# Altium schematic sheet OSSI-1 Beacon_2.SchDoc: TITLE:
size 410 x 286 mm; Date: Date:; >LAST_DATE_TIME: 01/11/2015 13:17:37; Sheet:: Sheet:; >SHEET: 3; REV:: REV:; Document Number:: Document Number:; >DRAWING_NAME: OSSI-1 Beacon.sch
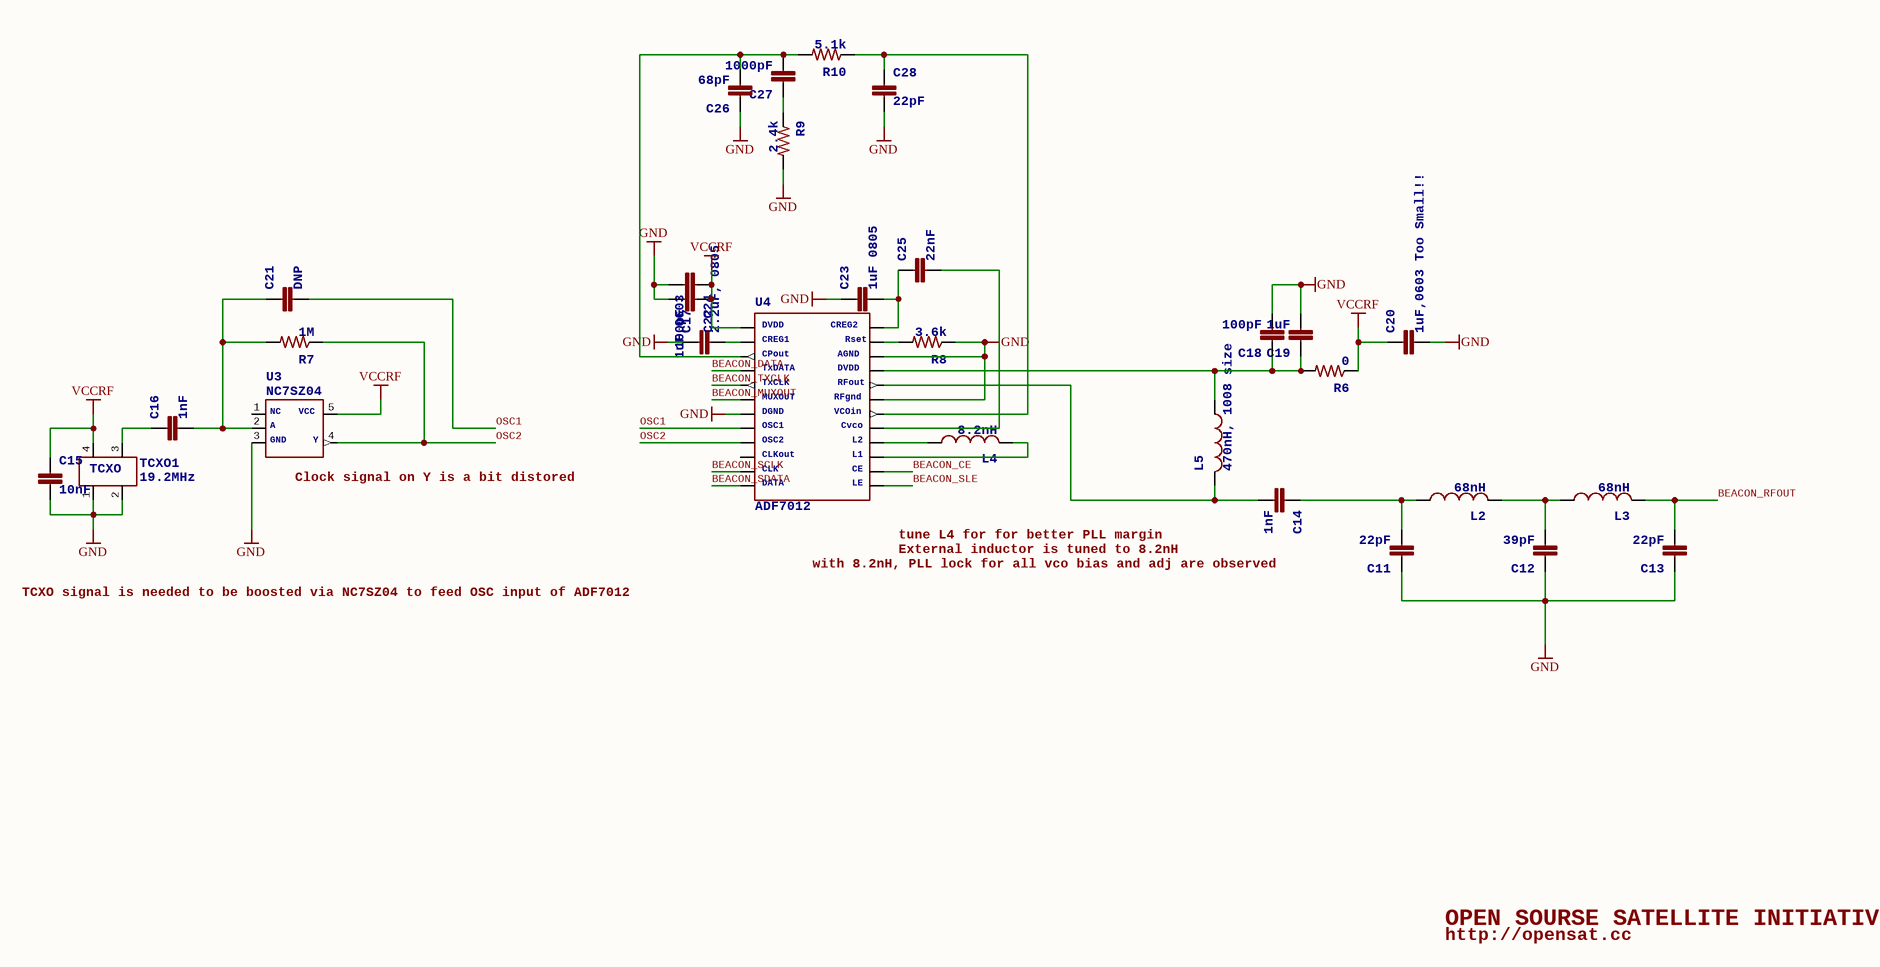
[diagram p0: OSSI-1 Beacon_2.SchDoc]

## Parts
C11  >NAME: C11  [C0603(1608)]  (hidden comment: 22pF)
C12  >NAME: C12  [C0603(1608)]  (hidden comment: 39pF)
C13  >NAME: C13  [C0603(1608)]  (hidden comment: 22pF)
C14  >NAME: C14  [C0603(1608)]  (hidden comment: 1nF)
C15  >NAME: C15  [C0603(1608)]  (hidden comment: 10nF)
C16  >NAME: C16  [C0603(1608)]  (hidden comment: 1nF)
C17  >NAME: C17  [C0805(2012)]  (hidden comment: 2.2uF, 0805)
C18  >NAME: C18  [C0603(1608)]  (hidden comment: 100pF)
C19  >NAME: C19  [C0603(1608)]  (hidden comment: 1uF)
C20  >NAME: C20  [C0603(1608)]  (hidden comment: 1uF,0603 Too Small!!)
C21  >NAME: C21  [C0603(1608)]  (hidden comment: DNP)
C22  >NAME: C22  [C0603(1608)]  (hidden comment: 100pF)
C23  >NAME: C23  [C0805(2012)]  (hidden comment: 1uF 0805)
C24  >NAME: C24  [C0603(1608)]  (hidden comment: 1uF,0603)
C25  >NAME: C25  [C0603(1608)]  (hidden comment: 22nF)
C26  >NAME: C26  [C0603(1608)]  (hidden comment: 68pF)
C27  >NAME: C27  [C0603(1608)]  (hidden comment: 1000pF)
C28  >NAME: C28  [C0603(1608)]  (hidden comment: 22pF)
L2  >NAME: L2  [L0603(1608)]  (hidden comment: 68nH)
L3  >NAME: L3  [L0603(1608)]  (hidden comment: 68nH)
L4  >NAME: L4  [L0603(1608)]  (hidden comment: 8.2nH)
L5  >NAME: L5  [L1008(2520)]  (hidden comment: 470nH, 1008 size)
R6  >NAME: R6  [R0603(1608)]  (hidden comment: 0)
R7  >NAME: R7  [R0603(1608)]  (hidden comment: 1M)
R8  >NAME: R8  [R0603(1608)]  (hidden comment: 3.6k)
R9  >NAME: R9  [R0603(1608)]  (hidden comment: 2.4k)
R10  >NAME: R10  [R0603(1608)]  (hidden comment: 5.1k)
TCXO1  >NAME: TCXO1  [TCXO_M532]  (hidden comment: 19.2MHz)
U3  >NAME: U3  [SC70-5]  (hidden comment: NC7SZ04)
U4  >NAME: U4  [TSSOP24]  (hidden comment: ADF7012)

## Nets
GND: C11.1 C12.1 C13.1 C15.2 C17.1 C18.2 C19.2 C20.2 C22.2 C23.1 C24.2 C26.1 C28.2 R8.1 R9.2 TCXO1.1(P$1) TCXO1.2(P$2) U3.3(P$3) U4.7(DGND) U4.19(RFGND) U4.22(AGND)
VCCRF: C15.1 C20.1 C22.1 C24.1 R6.1 TCXO1.4(P$4) U3.5(P$5) U4.1(DVDD_1)
BEACON_CE: U4.14(CE)
BEACON_DATA: U4.4(TXDATA)
BEACON_MUXOUT: U4.6(MUXOUT)
BEACON_RFOUT: C13.2 L3.2
BEACON_SCLK: U4.11(CLK)
BEACON_SDATA: U4.12(DATA)
BEACON_SLE: U4.13(LE)
BEACON_TXCLK: U4.5(TXCLK)
OSC1: C21.2 U4.8(OSC1)
OSC2: R7.1 U3.4(P$4) U4.9(OSC2)
NetC11_2: C11.2 C14.1 L2.1
NetC12_2: C12.2 L2.2 L3.1
NetC14_2: C14.2 L5.P$2 U4.20(RFOUT)
NetC16_1: C16.1 TCXO1.3(P$3)
NetC16_2: C16.2 C21.1 R7.2 U3.2(P$2)
NetC17_2: C17.2 U4.2(CREG1)
NetC18_1: C18.1 C19.1 L5.P$1 R6.2 U4.21(DVDD_2)
NetC23_2: C23.2 C25.1 U4.24(CREG2)
NetC25_2: C25.2 U4.17(CVCO)
NetC26_2: C26.2 C27.2 R10.2 U4.3(CPOUT)
NetC27_1: C27.1 R9.1
NetC28_1: C28.1 R10.1 U4.18(VCOIN)
NetL4_1: L4.1 U4.16(L2)
NetL4_2: L4.2 U4.15(L1)
NetR8_2: R8.2 U4.23(RSET)

Not connected (* = marked no-connect by the designer): U3 1(P$1); U4 10(CLKOUT)

## Notes on the sheet
- (near U3) Clock signal on Y is a bit distored
- TCXO signal is needed to be boosted via NC7SZ04 to feed OSC input of ADF7012
- with 8.2nH, PLL lock for all vco bias and adj are observed
- (near U4) tune L4 for for better PLL margin
- External inductor is tuned to 8.2nH
- OPEN SOURSE SATELLITE INITIATIVE
- http://opensat.cc

## Library data of the parts
C11-C16 C18-C22 C24-C28 = C0603(1608)
  C11 C13 C28: >VALUE: 22pF
  C12: >VALUE: 39pF
  C14 C16: >VALUE: 1nF
  C15: >VALUE: 10nF
  C18 C22: >VALUE: 100pF
  C19: >VALUE: 1uF
  C20: >VALUE: 1uF,0603 Too Small!!
  C21: >VALUE: DNP
  C24: >VALUE: 1uF,0603
  C25: >VALUE: 22nF
  C26: >VALUE: 68pF
  C27: >VALUE: 1000pF
C17 C23 = C0805(2012)
  C17: >VALUE: 2.2uF, 0805
  C23: >VALUE: 1uF 0805
L2-L4 = L0603(1608)
  L2 L3: >VALUE: 68nH
  L4: >VALUE: 8.2nH
L5 = L1008(2502): >VALUE: 470nH, 1008 size
R6-R10 = R0603(1608)
  R6: >VALUE: 0
  R7: >VALUE: 1M
  R8: >VALUE: 3.6k
  R9: >VALUE: 2.4k
  R10: >VALUE: 5.1k
TCXO1 = TCXO-M532: <b>532L25DT19M2000: CTO electronic components Model 532 19.2MHz TCXO for RF transeiver</b> / <ul> / <li>Clipped Sine Wave Output</li> / <li>Operating Voltage, +3.3Vdc</li> / <li>Operating Temperature to -30°C to +85°C</li> / <li>Frequency Stability: ±2.5ppm</li> / </ul>; TCXO: TCXO; >VALUE: 19.2MHz
U3 = NC7SZ04: UHS Inverter NC7SZ04; >VALUE: NC7SZ04; NC: NC; A: A; GND: GND; VCC: VCC; Y: Y
U4 = ADF7012: >VALUE: ADF7012; DVDD: DVDD; CREG1: CREG1; CPout: CPout; TxDATA: TxDATA; MUXOUT: MUXOUT; DGND: DGND; OSC1: OSC1; OSC2: OSC2; CLKout: CLKout; CLK: CLK; DATA: DATA; TxCLK: TxCLK; LE: LE; CE: CE; L1: L1; L2: L2; Cvco: Cvco; VCOin: VCOin; RFgnd: RFgnd; RFout: RFout; AGND: AGND; Rset: Rset; CREG2: CREG2